# EAGLE design voc_sensor (EAGLE 6.5.0)
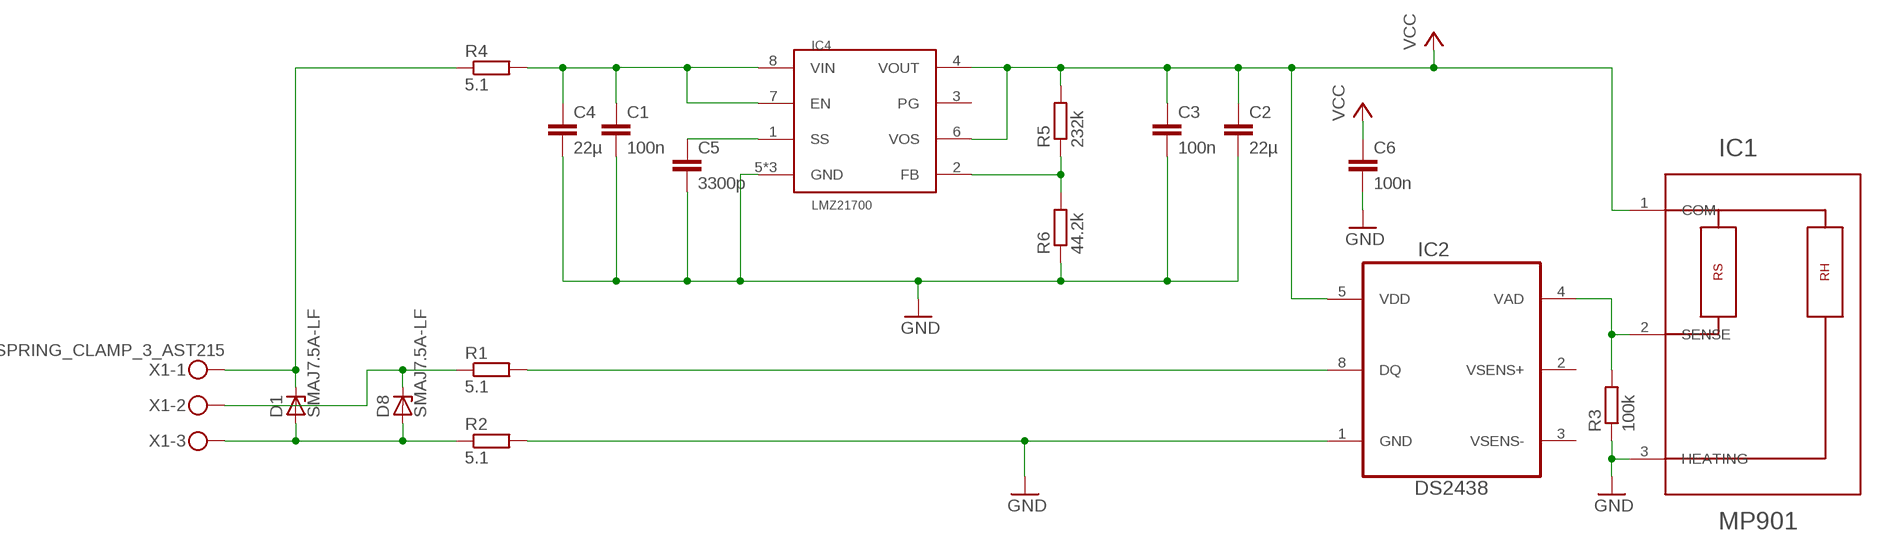
[diagram p0: schematic, sheet 1]

## Parts
C1  100n  C-EUC0402  [C0402]
C2  22µ  C-EUC0805K  [C0805K]
C3  100n  C-EUC0402  [C0402]
C4  22µ  C-EUC0805K  [C0805K]
C5  3300p  C-EUC0402  [C0402]
C6  100n  C-EUC0402  [C0402]
D1  SMAJ7.5A-LF  ZENER  [DO214AC]
D8  SMAJ7.5A-LF  ZENER  [DO214AC]
IC1  MP901  [MP901]
IC2  DS2438  [SO-08]
IC4  LMZ21700  [LMZ21700]
R1  5.1  R-EU_R0402  [R0402]
R2  5.1  R-EU_R0402  [R0402]
R3  100k  R-EU_R0402  [R0402]
R4  5.1  R-EU_R0402  [R0402]
R5  232k  R-EU_R0402  [R0402]
R6  44.2k  R-EU_R0402  [R0402]
X1  SPRING_CLAMP_3_AST215  [AST215_3]

## Nets
GND: C1.2 C2.2 C3.2 C4.2 C5.2 C6.2 IC1.3(HEATING) IC2.1(GND) IC4.5(GND) IC4.TPAD@1(GND) IC4.TPAD@2(GND) R2.2 R3.1 R6.1
N$1: IC1.2(SENSE) IC2.4(VAD) R3.2
N$3: C1.1 C4.1 IC4.7(EN) IC4.8(VIN) R4.2
N$4: D1.C R4.1 X1.1A X1.1B
N$5: D1.A D8.A R2.1 X1.3A X1.3B
N$6: C5.1 IC4.1(SS)
N$7: IC4.2(FB) R5.1 R6.2
N$10: D8.C R1.1 X1.2A X1.2B
N$20: IC2.8(DQ) R1.2
VCC: C2.1 C3.1 C6.1 IC1.1(COM) IC2.5(VDD) IC4.4(VOUT) IC4.6(VOS) R5.2
Unconnected: IC2.2(VSENS+) IC2.3(VSENS-) IC4.3(PG)

## Library data of the parts
C1-C6 = rcl:C-EU: CAPACITOR, European symbol
D1 D8 = diodes:ZENER
IC1 = sensor:MP901
IC2 = 1wire:DS2438: Smart Battery Monitor
IC4 = ic_voltage_regulator:LMZ21700
R1-R6 = rcl:R-EU_: RESISTOR, European symbol
X1 = connectors:SPRING_CLAMP_3

## Board
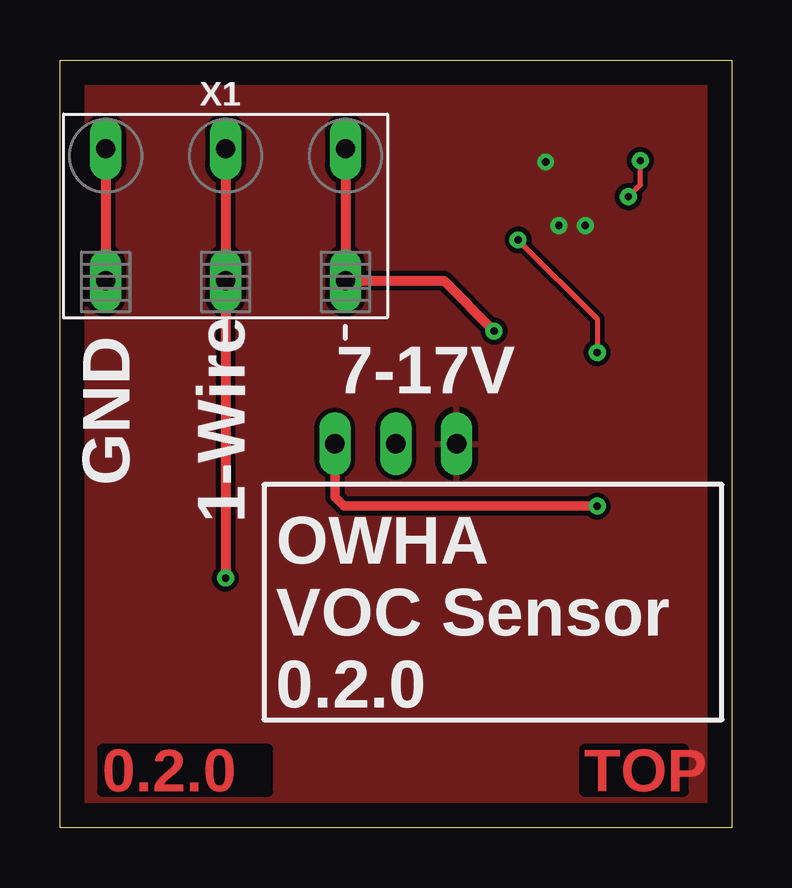
[diagram p1: board, top side]
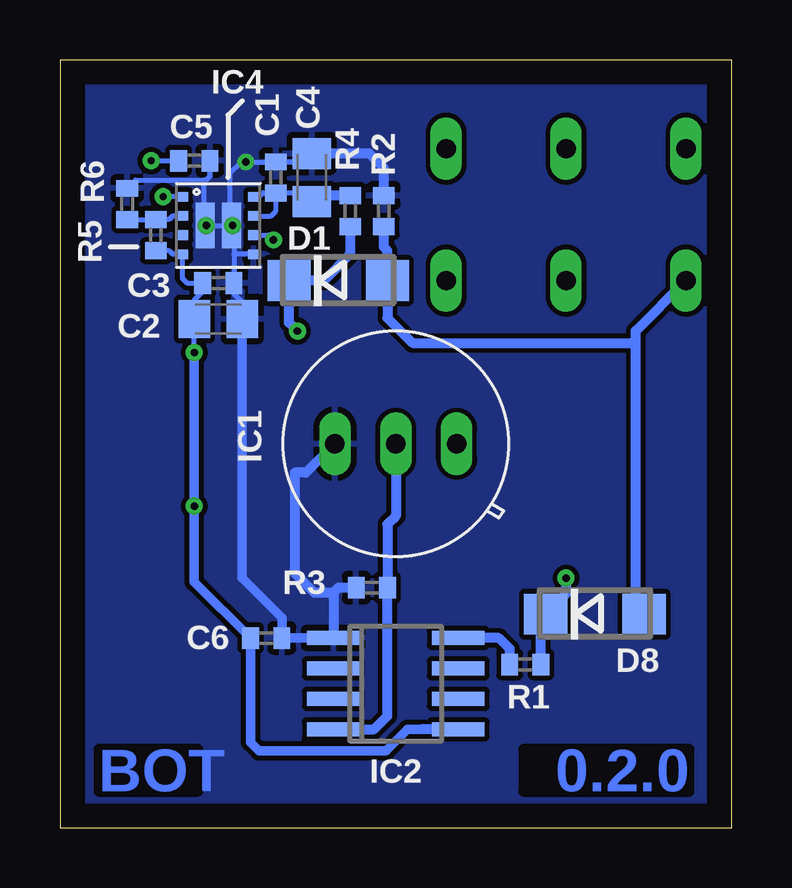
[diagram p2: board, bottom side, seen from below]

Size 28 x 32 mm. Coordinates in mm from the lower left corner, seen from the top.
Outline: 0,0 0,32 28,32 28,0 0,0
Copper layers (1*16): Top 0.035mm / dielectric 1mm / Bottom 0.035mm
Design rules "default *": minimum track width 6mil, minimum drill 0.3mm, track to track 8mil, track to pad 8mil, pad to pad 8mil, via to via 8mil, smd to smd 8mil, copper to edge 40mil, drill to drill 8mil, minimum pad ring 10mil, minimum via ring 8mil, stop-mask expansion 4mil, vias tented up to drill 0mil, thermal gap 10mil
tKeepout: area 8,30 to 20,32; area 8,0 to 20,2
bKeepout: area 0,11 to 3,21; area 25,11 to 28,21

### Footprints (pad centres in the part's own frame; a part is rotated, then mirrored left to right if it is on the bottom)
C0402 = smd 0.7 x 0.9: 1 -0.65,0; 2 0.65,0
C0805K = smd 1.3 x 1.6: 1 -1,0; 2 1,0
DO214AC = smd 1.8 x 1.7: A 2.05,0; C -2.05,0
MP901 = drill 0.8 long: 1 2.54,0; 2 0,0; 3 -2.54,0
SO-08 = smd 2.2 x 0.6: 1 -2.6,1.905; 2 -2.6,0.635; 3 -2.6,-0.635; 4 -2.6,-1.905; 5 2.6,-1.905; 6 2.6,-0.635; 7 2.6,0.635; 8 2.6,1.905
LMZ21700 = smd 0.45 x 0.4: 1 -1.475,1.2; 2 -1.475,0.4; 3 -1.475,-0.4; 4 -1.475,-1.2; 5 1.475,-1.2; 6 1.475,-0.4; 7 1.475,0.4; 8 1.475,1.2 | smd 0.8 x 1.9: TPAD@1 -0.55,0; TPAD@2 0.55,0
R0402 = smd 0.7 x 0.9: 1 -0.65,0; 2 0.65,0
AST215_3 = drill 0.8 long: 1A -5,-2.8; 1B -5,2.7; 2A 0,-2.8; 2B 0,2.7; 3A 5,-2.8; 3B 5,2.7

### Placement (x,y rotation side)
C1  19,27.1 90 bottom
C2  21.4,21.2 0 bottom
C3  21.4,22.7 0 bottom
C4  17.5,27.1 90 bottom
C5  22.4,27.8 0 bottom
C6  19.4,7.9 0 bottom
D1  16.4,22.8 0 bottom
D8  5.7,8.9 0 bottom
IC1  14,16 0 bottom
IC2  14,6 0 bottom
IC4  21.4,25.1 0 bottom
R1  8.6,6.8 180 bottom
R2  14.5,25.7 90 bottom
R3  15,10 0 bottom
R4  15.9,25.7 90 bottom
R5  24,24.7 270 bottom
R6  25.2,26 270 bottom
X1  6.9,25.5 180 top

### Tracks (layer width: path | path; a pad name or v marks a point on that pad's centre or on a via)
GND  (via drill 0.3)
  Bottom 0.2: R6.1 24.85,27 22,27 | 22,27 21.9,27 21.75,27.15 C5.2 | 22,27 22,25.15 IC4.TPAD@1 v21.9,25.1 IC4.TPAD@2 | IC4.TPAD@2 20.9,25.15 20.9,27.3 20.45,27.75 v20.25,27.75 C1.2 17.85,27.75 C4.2 | IC4.TPAD@2 20.75,25 20.75,23.9 | 20.75,23.9 C3.2 20.75,22.25 20.4,21.9 C2.2 | IC4.5 20.75,23.9 | IC4.TPAD@2 v20.8,25.1
  Bottom 0.4: IC2.1 C6.2 18.75,8.75 20.4,10.4 C2.2
  Bottom 0.406: R3.1 16.4,10 16.6,9.8 | 16.6,9.8 IC2.1 | IC1.3 17.74,14.8 18.2,14.8 18.2,10.6 17.4,9.8 16.6,9.8 | R2.2 14.5,27.5 15.1,28.1 C4.2
  pour Bottom: 0,32 28,32 28,0 0,0
  pour Top: 0,32 28,32 28,0 0,0
N$1
  Bottom 0.406: IC1.2 14,13 14.35,12.65 R3.2 14.35,4.65 14.9,4.09 IC2.4
N$3
  Bottom 0.2: IC4.7 19.2,25.5 19,25.7 C1.1 | IC4.8 19.7,26.3 19.55,26.45 C1.1 | C4.1 17.85,26.45 C1.1
  Bottom 0.406: R4.2 17.25,26.35 C4.1
N$4  (via drill 0.3)
  Top 0.406: X1.1A X1.1B 16,22.8 v18.1,20.7
  Bottom 0.406: v18.1,20.7 18.45,21.05 D1.C 17,22.8 15.9,23.9 R4.1
N$5
  Top 0.406: X1.3A X1.3B
  Bottom 0.406: 4,20.2 4,9.2 3.95,9.2 D8.A | 4,20.2 4,20.7 X1.3B 1.9,22.9 | 4,20.2 13.3,20.2 14.35,21.25 D1.A 14.35,24.05 14.5,24.2 R2.1
N$6  (via drill 0.3)
  Top 0.2: v23.7,26.3 24.2,26.8 v24.2,27.8
  Bottom 0.2: IC4.1 v23.7,26.3 | v24.2,27.8 C5.1
N$7
  Bottom 0.2: IC4.2 23.3,25.5 23.45,25.35 R5.1 R6.2
N$10  (via drill 0.3)
  Top 0.406: X1.2A X1.2B v6.9,10.4
  Bottom 0.406: R1.1 7.95,8.7 D8.C 6.9,9.75 v6.9,10.4
N$20
  Bottom 0.406: R1.2 9.25,7.45 9.71,7.91 IC2.8
VCC  (via drill 0.3)
  Top 0.2: v19.1,24.5 C2.1 v22.4,19.8
  Top 0.4: IC1.1 11.46,13.79 11.85,13.4 v22.4,13.4
  Bottom 0.2: R5.2 23.45,24.05 23.3,23.9 IC4.4 22.9,23.88 22.9,22.9 22.7,22.7 C3.1 22.05,22.35 22.4,22 C2.1 v22.4,19.8 | IC4.6 19.3,24.7 v19.1,24.5
  Bottom 0.4: 12.89,4.09 13.51,4.09 14.4,3.2 19.7,3.2 20.05,3.55 C6.1 22.4,10.25 v22.4,13.4 v22.4,19.8
  Bottom 0.406: IC2.5 12.89,4.09

### Text on the board
Top: TOP
Bottom: BOT
tPlace: 1-Wire | GND | 7-17V | OWHA | VOC Sensor
tDocu: TOP
bDocu: BOT